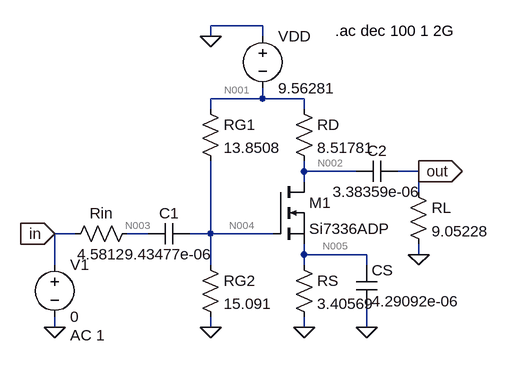
[diagram p0: schematic cs_amplifier_with_plot.asc]
cs_amplifier_with_plot.asc, the LTspice schematic file:
Version 4.1
SHEET 1 1116 680
WIRE 336 -240 256 -240
WIRE 256 -224 256 -240
WIRE 336 -224 336 -240
WIRE 336 -128 336 -144
WIRE 336 -128 256 -128
WIRE 400 -128 336 -128
WIRE 256 -112 256 -128
WIRE 400 -112 400 -128
WIRE 400 -16 400 -32
WIRE 480 -16 400 -16
WIRE 576 -16 544 -16
WIRE 400 0 400 -16
WIRE 576 16 576 -16
WIRE 48 80 16 80
WIRE 160 80 128 80
WIRE 256 80 256 -32
WIRE 256 80 224 80
WIRE 352 80 256 80
WIRE 400 112 400 96
WIRE 496 112 400 112
WIRE 576 112 576 96
WIRE 16 128 16 80
WIRE 256 128 256 80
WIRE 400 128 400 112
WIRE 496 128 496 112
WIRE 16 224 16 208
WIRE 256 224 256 208
WIRE 400 224 400 208
WIRE 496 224 496 192
FLAG 256 224 0
FLAG 16 224 0
FLAG 576 112 0
FLAG 400 224 0
FLAG 256 -224 0
FLAG 16 80 in
IOPIN 16 80 In
FLAG 576 -16 out
IOPIN 576 -16 Out
FLAG 496 224 0
SYMBOL voltage 16 112 R0
WINDOW 123 24 124 Left 2
WINDOW 39 0 0 Left 0
SYMATTR Value2 AC 1
SYMATTR InstName V1
SYMATTR Value 0
SYMBOL cap 224 64 R90
WINDOW 0 0 32 VBottom 2
WINDOW 3 32 32 VTop 2
SYMATTR InstName C1
SYMATTR Value 9.43477e-06
SYMBOL res 240 -128 R0
SYMATTR InstName RG1
SYMATTR Value 13.8508
SYMBOL res 240 112 R0
SYMATTR InstName RG2
SYMATTR Value 15.091
SYMBOL nmos 352 0 R0
SYMATTR InstName M1
SYMATTR Value Si7336ADP
SYMBOL res 384 -128 R0
SYMATTR InstName RD
SYMATTR Value 8.51781
SYMBOL cap 544 -32 R90
WINDOW 0 0 32 VBottom 2
WINDOW 3 32 32 VTop 2
SYMATTR InstName C2
SYMATTR Value 3.38359e-06
SYMBOL res 560 0 R0
SYMATTR InstName RL
SYMATTR Value 9.05228
SYMBOL voltage 336 -240 R0
SYMATTR InstName VDD
SYMATTR Value 9.56281
SYMBOL res 384 112 R0
SYMATTR InstName RS
SYMATTR Value 3.40569
SYMBOL cap 480 128 R0
SYMATTR InstName CS
SYMATTR Value 4.29092e-06
SYMBOL res 144 64 R90
WINDOW 0 0 56 VBottom 2
WINDOW 3 32 56 VTop 2
SYMATTR InstName Rin
SYMATTR Value 4.5812
TEXT 448 -232 Left 2 !.ac dec 100 1 2G

The netlist it stands for:
* cs_amplifier_with_plot.asc
V1 in 0 0 AC 1
C1 N004 N003 9.43477e-06
RG1 N001 N004 13.8508
RG2 N004 0 15.091
M1 N002 N004 N005 N005 Si7336ADP
RD N001 N002 8.51781
C2 out N002 3.38359e-06
RL out 0 9.05228
VDD 0 N001 9.56281
RS N005 0 3.40569
CS N005 0 4.29092e-06
Rin N003 in 4.5812
.model NMOS NMOS
.model PMOS PMOS
.lib standard.mos
.ac dec 100 1 2G
.backanno
.end

* Results of the author's LTspice run, read from the files saved beside the schematic
* Operating Point, zero values left out:
*   V(n004) = -4.986 V
*   V(n001) = -9.563 V
*   V(n002) = -3.208 V
*   V(n005) = -2.541 V
*   I(RG1) = -330.4 mA
*   Id(M1) = -746 mA
*   Ig(M1) = -395.4 pA
*   Is(M1) = 746 mA
*   I(RD) = -746 mA
*   I(VDD) = -1.076 A
*   I(RG2) = -330.4 mA
*   I(RS) = -746 mA
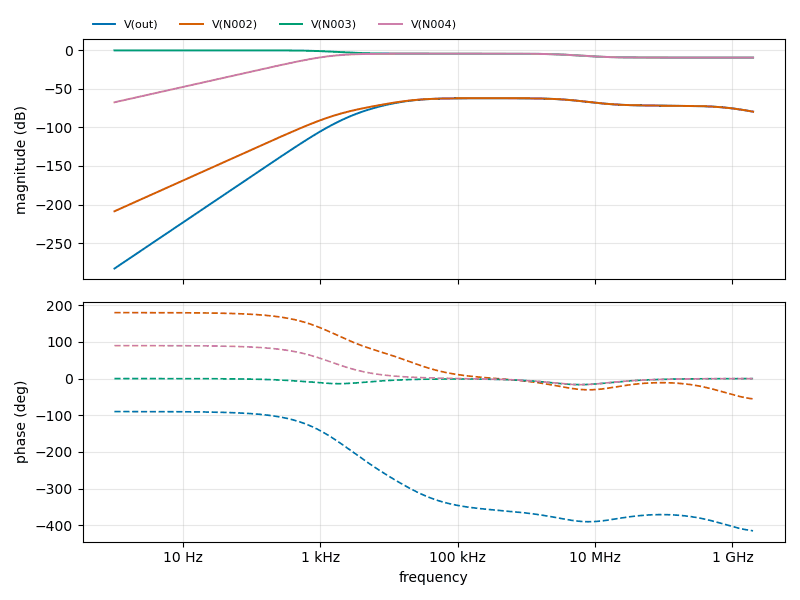
[diagram p1: AC Analysis of cs_amplifier_with_plot.asc, plotted from the saved traces]
* AC Analysis, 1 run:
*   V(out): -283.06 dB at 1 Hz, -79.55 dB at 2 GHz, peak -62.08 dB at 316.2 kHz, 3 dB below the peak at 21.19 kHz and 5.155 MHz
*   V(N002): -208.75 dB at 1 Hz, -79.55 dB at 2 GHz, peak -62.08 dB at 309 kHz, 3 dB below the peak at 19.94 kHz and 5.153 MHz
*   V(N003): -0.00 dB at 1 Hz, -9.38 dB at 2 GHz, peak -0.00 dB at 1 Hz, 3 dB below the peak at 2.854 kHz
*   V(N004): -67.37 dB at 1 Hz, -9.38 dB at 2 GHz, peak -4.27 dB at 89.13 kHz, 3 dB below the peak at 1.428 kHz and 7.31 MHz